# Altium schematic sheet Power_Sheet.SchDoc
size A3; SheetNumber: 2; SheetTotal: 5
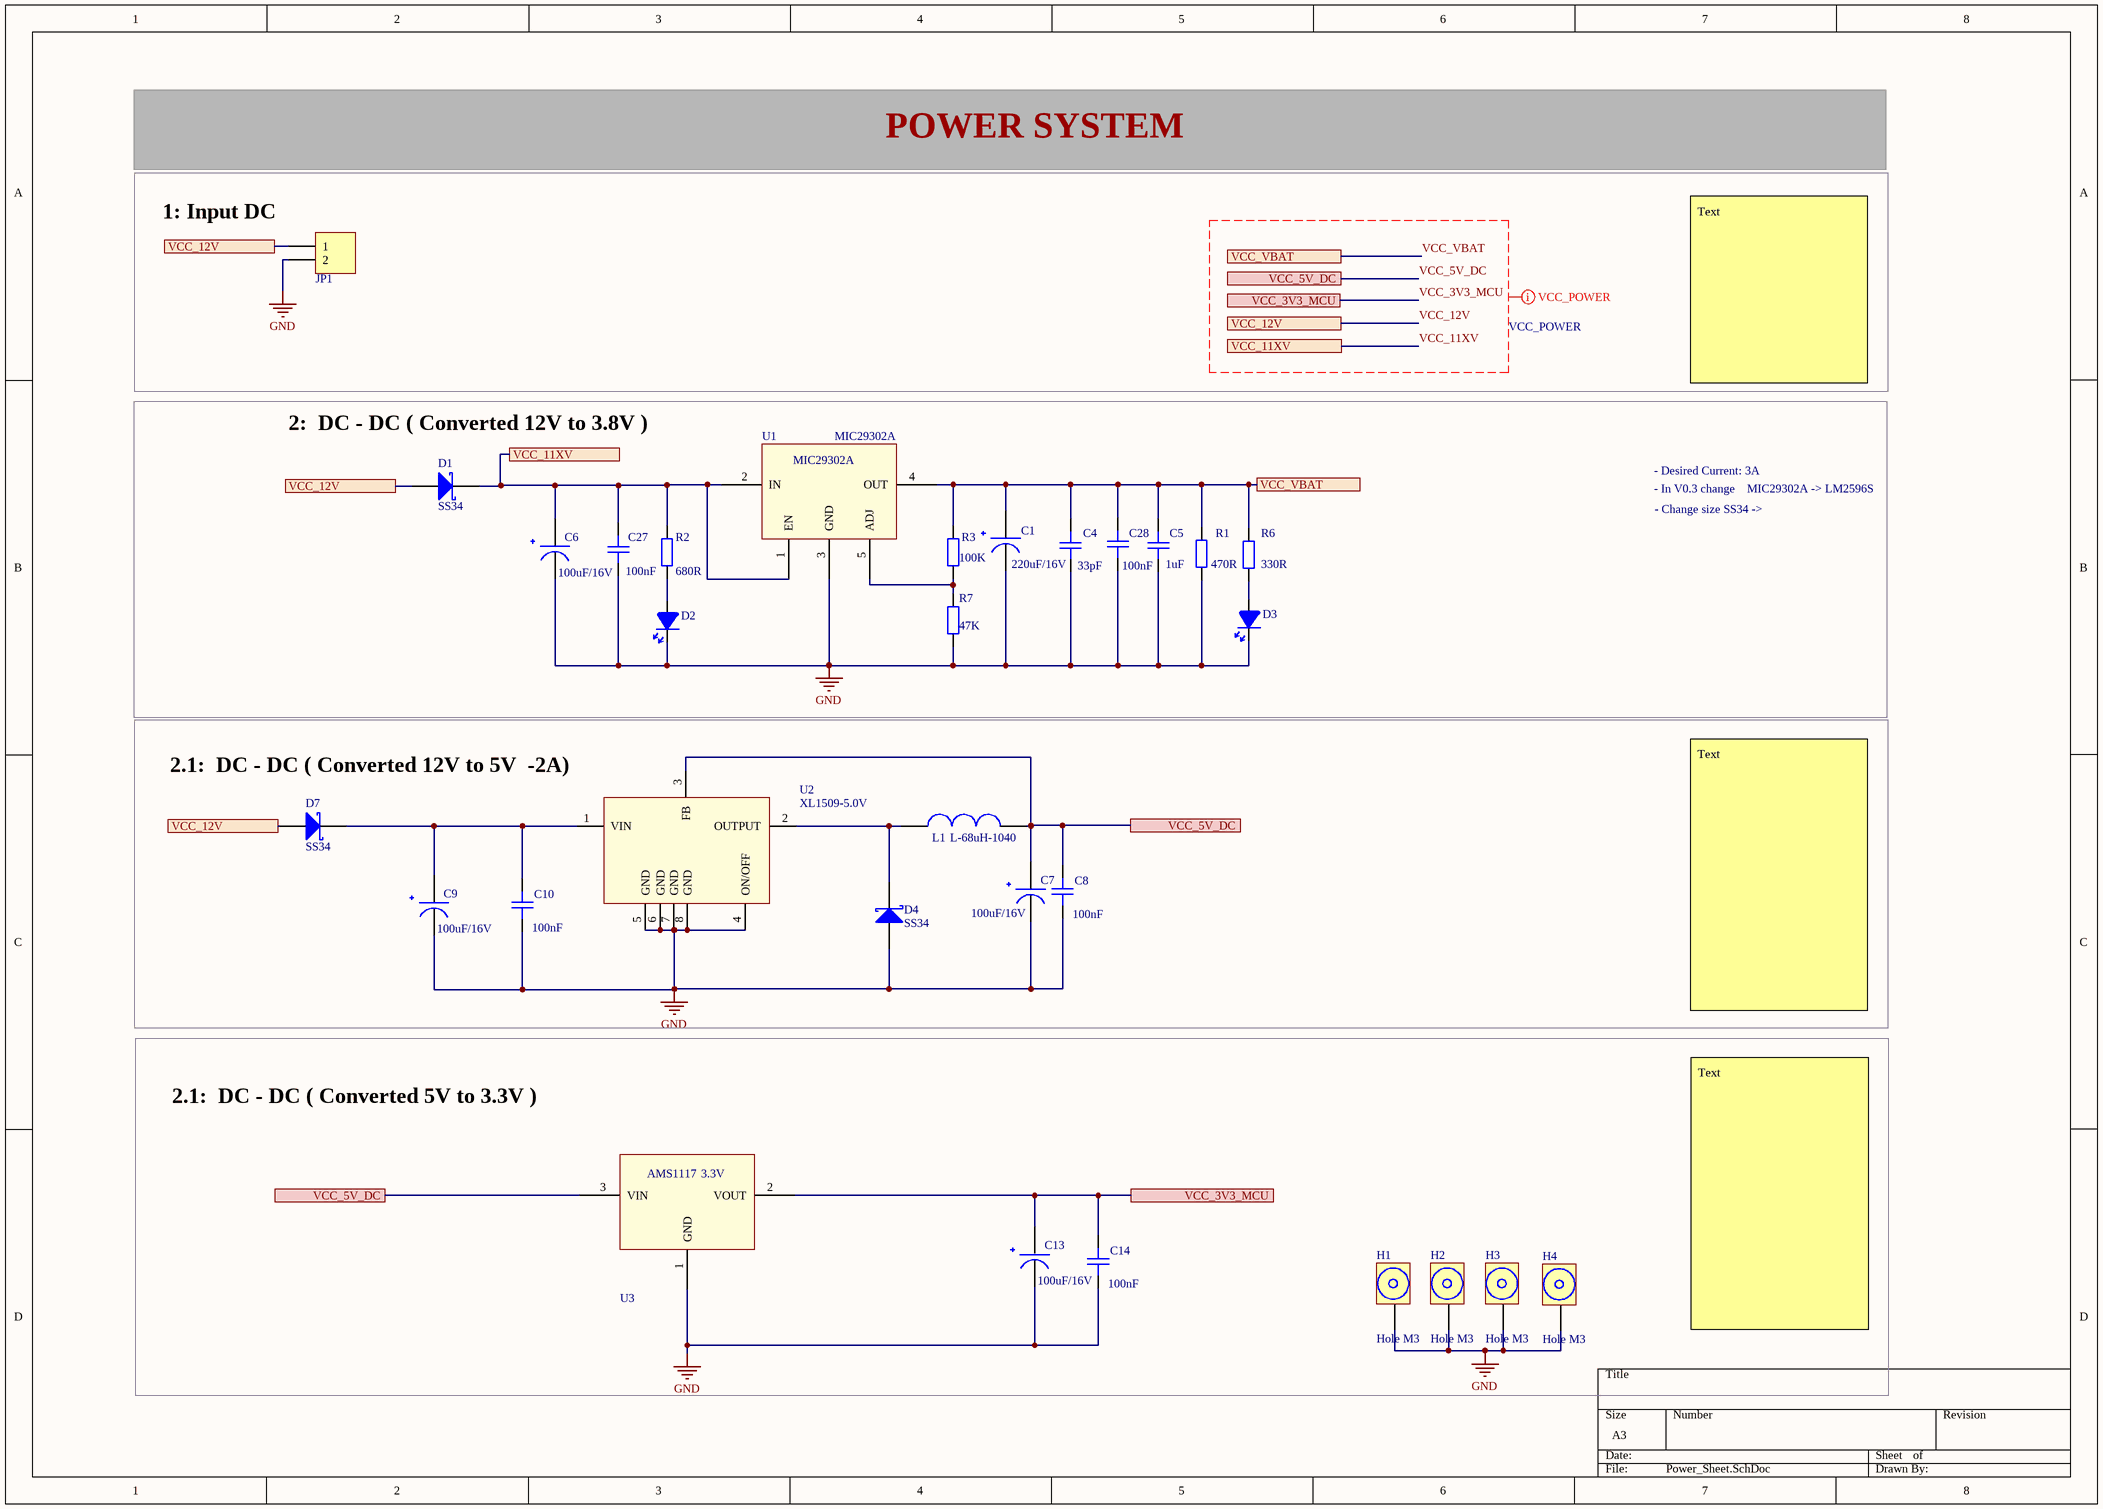
[diagram p0: Power_Sheet.SchDoc]

## Parts
C1  220uF/16V  [CAPACITOR 6.3x7.7mm]
C4  33pF  [CAPC-0603 (1608)]
C5  1uF  [CAPC-0603 (1608)]
C6  100uF/16V  [CAP 6.3MMx5.4MM]
C7  100uF/16V  [CAP 6.3MMx5.4MM]
C8  100nF  [CAPC-0603 (1608)]
C9  100uF/16V  [CAP 6.3MMx5.4MM]
C10  100nF  [CAPC-0603 (1608)]
C13  100uF/16V  [CAP 6.3MMx5.4MM]
C14  100nF  [CAPC-0603 (1608)]
C27  100nF  [CAPC-0603 (1608)]
C28  100nF  [CAPC-0603 (1608)]
D1  SS34  [DIODE_DO214AC_SMA]
D2  LED_0805_PW  [LED_0805_PW]  (value not drawn)
D3  LED_0805_PW  [LED_0805_PW]  (value not drawn)
D4  SS34  [DIODE_DO214AC_SMA]
D7  SS34  [DIODE_DO214AC_SMA]
H1  Hole M3  [Hole Size 3M]
H2  Hole M3  [Hole Size 3M]
H3  Hole M3  [Hole Size 3M]
H4  Hole M3  [Hole Size 3M]
JP1  Header 2_1  [HED2]  (value not drawn)
L1  L-68uH-1040  [68uH - 2A - 1040]
R1  470R  [RESC-0603 (1608)]
R2  680R  [RESC-0603 (1608)]
R3  100K  [RESC-0603 (1608)]
R6  330R  [RESC-0603 (1608)]
R7  47K  [RESC-0603 (1608)]
U1  MIC29302A  [MIC29302A]
U2  XL1509-5.0V  [XL1509-5V]
U3  AMS1117 - 3.3V  [AMS1117 -3.3V]  (value not drawn)

## Blocks framed on the sheet
1: Input DC: JP1
2:  DC - DC ( Converted 12V to 3.8V ): C1 C4-C6 C27 C28 D1-D3 R1-R3 R6 R7 U1
2.1:  DC - DC ( Converted 12V to 5V  -2A): C7-C10 D4 D7 L1 U2
2.1:  DC - DC ( Converted 5V to 3.3V ): C13 C14 H1-H4 U3

## Ports
VCC_3V3_MCU, VCC_5V_DC, VCC_11XV, VCC_12V, VCC_VBAT

## Nets
GND: C1.2 C4.1 C5.1 C6.2 C7.2 C8.1 C9.2 C10.1 C13.2 C14.1 C27.1 C28.1 D2.2(K) D3.2(K) D4.1(A) H1.1(GND) H2.1(GND) H3.1(GND) H4.1(GND) JP1.2 R1.1 R7.1 U1.3(GND) U2.4(ON/OFF) U2.5(GND) U2.6(GND) U2.7(GND) U2.8(GND) U3.1(GND)
VCC_3V3_MCU: C13.1 C14.2 U3.2(VOUT) ; port VCC_3V3_MCU
VCC_5V_DC: C7.1 C8.2 L1.2 U2.3(FB) U3.3(VIN) ; port VCC_5V_DC
VCC_11XV: C6.1 C27.2 D1.2(K) R2.2 U1.1(EN) U1.2(IN) ; port VCC_11XV
VCC_12V: D1.1(A) D7.1(A) JP1.1 ; port VCC_12V
VCC_VBAT: C1.1 C4.2 C5.2 C28.2 R1.2 R3.1 R6.2 U1.4(OUT) ; port VCC_VBAT
NetC9_1: C9.1 C10.2 D7.2(K) U2.1(VIN)
NetD2_1: D2.1(A) R2.1
NetD3_1: D3.1(A) R6.1
NetD4_2: D4.2(K) L1.1 U2.2(OUTPUT)
NetR3_2: R3.2 R7.2 U1.5(ADJ)

## Layout directives
net class VCC_POWER: VCC_3V3_MCU, VCC_5V_DC, VCC_11XV, VCC_12V, VCC_VBAT

## Notes on the sheet
- POWER SYSTEM
- Text
- - Desired Current: 3A
- - In V0.3 change    MIC29302A -> LM2596S
- - Change size SS34 ->
- (in symbol AMS1117 - 3.3V) AMS1117; 3.3V

## Library data of the parts
C1 = CAP 220uF: Capacitor 220uF - 16V. Size 6.3x7,7mm
C4 C5 C8 C10 C14 C27 C28 = CAPC NF 0603: CAP SMD, Not Fill, 0603; Value: NF; Solder: Not Fill; Category: CAPACITOR
C6 C7 C9 C13 = CAP 100uF: Capacitor 100uF - 16V. Size 6.3x5.4mm
D1 D4 D7 = SS34: DIODE SCHOTTKY 40V 3A SMA; Solder: SMT; MPN: SS34; Value: SS34; MFR: *
JP1 = Header 2_1: Header, 2-Pin; Manufacturer: Generic Components; Class: Connector; Value: Header 2
R1-R3 R6 R7 = CRCW06035R10FKEA: RES SMD 5.1 OHM 1% 1/10W 0603; MFR: Vishay Dale; Value: 5.1R; Solder: SMT; MPN: CRCW06035R10FKEA; Category: RESISTOR; PinCount: 2
U2 = XL1509-5V: XL1509-5V FROM XLSEMI